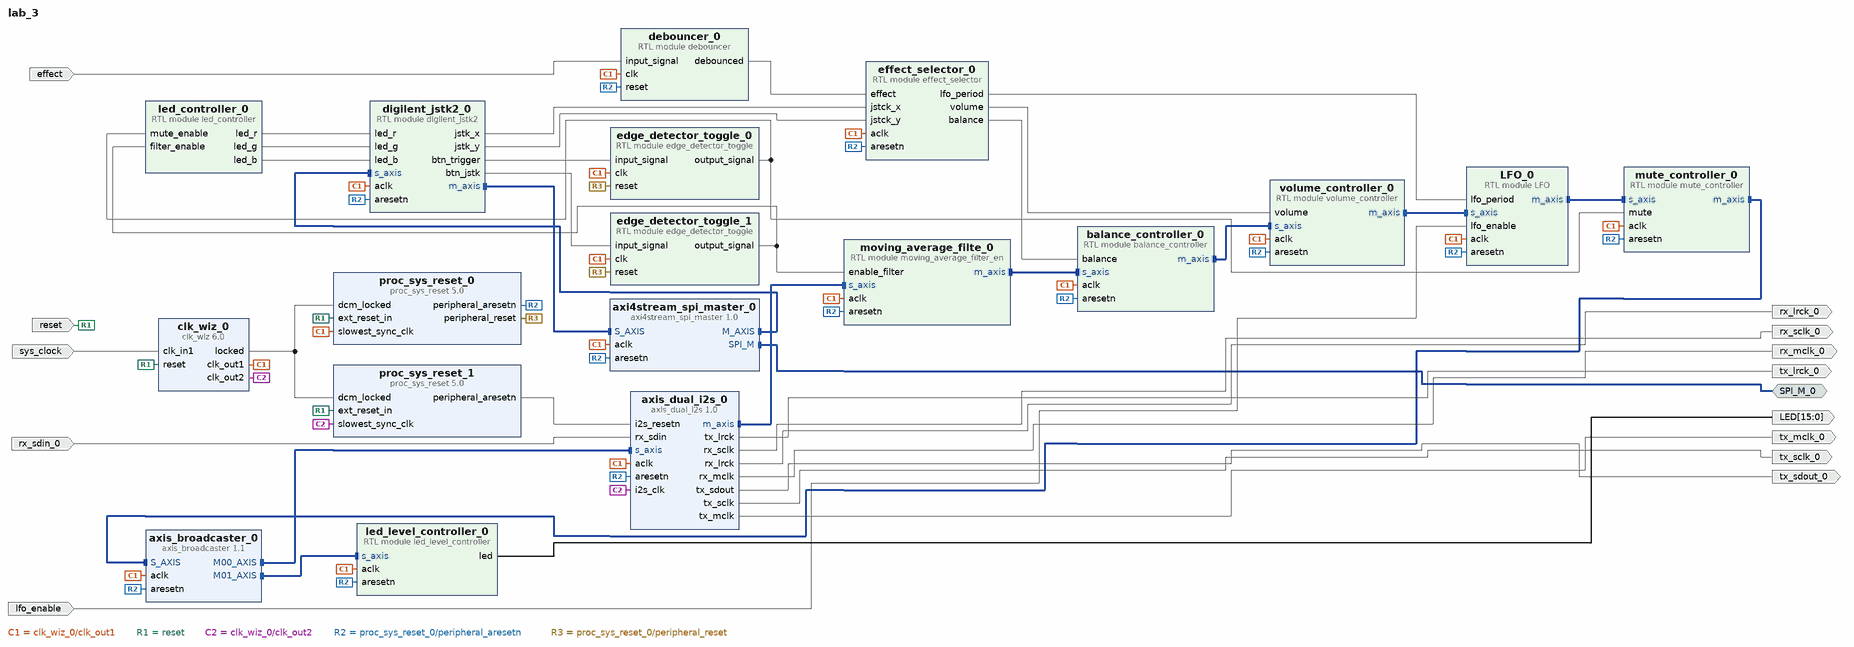
[diagram p0: block diagram of the top level]
# Vivado block design lab_3, xc7a35tcpg236-1, Vivado 2020.2
create_bd_design lab_3

create_bd_intf_port -mode Master -vlnv xilinx.com:interface:spi_rtl:1.0 SPI_M_0
create_bd_port -dir I -type clk sys_clock
set_property -dict {CONFIG.FREQ_HZ 100000000 CONFIG.PHASE 0.000} [get_bd_ports sys_clock]
create_bd_port -dir I -type rst reset
set_property -dict {CONFIG.POLARITY ACTIVE_HIGH} [get_bd_ports reset]
create_bd_port -dir O tx_lrck_0
create_bd_port -dir I rx_sdin_0
create_bd_port -dir O rx_sclk_0
create_bd_port -dir O rx_lrck_0
create_bd_port -dir O rx_mclk_0
create_bd_port -dir O tx_sdout_0
create_bd_port -dir O tx_sclk_0
create_bd_port -dir O tx_mclk_0
create_bd_port -dir I lfo_enable
create_bd_port -dir I effect
create_bd_port -dir O -from 15 -to 0 LED

create_bd_cell -type ip -vlnv xilinx.com:ip:clk_wiz:6.0 clk_wiz_0
set_property -dict [list \
  CONFIG.CLKOUT1_JITTER 149.337 \
  CONFIG.CLKOUT1_PHASE_ERROR 122.577 \
  CONFIG.CLKOUT1_REQUESTED_OUT_FREQ 100 \
  CONFIG.CLKOUT2_JITTER 201.826 \
  CONFIG.CLKOUT2_PHASE_ERROR 122.577 \
  CONFIG.CLKOUT2_REQUESTED_OUT_FREQ 22.579 \
  CONFIG.CLKOUT2_USED true \
  CONFIG.CLK_IN1_BOARD_INTERFACE sys_clock \
  CONFIG.MMCM_CLKFBOUT_MULT_F 7.000 \
  CONFIG.MMCM_CLKOUT0_DIVIDE_F 7.000 \
  CONFIG.MMCM_CLKOUT1_DIVIDE 31 \
  CONFIG.MMCM_DIVCLK_DIVIDE 1 \
  CONFIG.NUM_OUT_CLKS 2 \
  CONFIG.RESET_BOARD_INTERFACE reset \
  CONFIG.USE_BOARD_FLOW true \
  CONFIG.USE_LOCKED true \
] [get_bd_cells clk_wiz_0]
create_bd_cell -type ip -vlnv xilinx.com:ip:proc_sys_reset:5.0 proc_sys_reset_0
create_bd_cell -type ip -vlnv xilinx.com:ip:proc_sys_reset:5.0 proc_sys_reset_1
create_bd_cell -type module -reference digilent_jstk2 digilent_jstk2_0
set_property -dict {CONFIG.CLKFREQ 215000000} [get_bd_cells digilent_jstk2_0]
create_bd_cell -type module -reference edge_detector_toggle edge_detector_toggle_0
create_bd_cell -type module -reference edge_detector_toggle edge_detector_toggle_1
create_bd_cell -type module -reference debouncer debouncer_0
set_property -dict {CONFIG.CLOCK_FREQ 200000000} [get_bd_cells debouncer_0]
create_bd_cell -type ip -vlnv xilinx.com:ip:axis_broadcaster:1.1 axis_broadcaster_0
create_bd_cell -type module -reference moving_average_filter_en moving_average_filte_0
create_bd_cell -type module -reference volume_controller volume_controller_0
set_property -dict {CONFIG.LOWER_BOUND -8388608} [get_bd_cells volume_controller_0]
create_bd_cell -type module -reference LFO LFO_0
set_property -dict {CONFIG.CLK_PERIOD_NS 10} [get_bd_cells LFO_0]
create_bd_cell -type module -reference balance_controller balance_controller_0
create_bd_cell -type module -reference effect_selector effect_selector_0
create_bd_cell -type module -reference led_controller led_controller_0
create_bd_cell -type module -reference led_level_controller led_level_controller_0
set_property -dict {CONFIG.clock_period_ns 10} [get_bd_cells led_level_controller_0]
create_bd_cell -type module -reference mute_controller mute_controller_0
create_bd_cell -type ip -vlnv DigiLAB:ip:axi4stream_spi_master:1.0 axi4stream_spi_master_0
set_property -dict {CONFIG.c_clkfreq 215000000 CONFIG.c_sclkfreq 5000} [get_bd_cells axi4stream_spi_master_0]
create_bd_cell -type ip -vlnv DigiLAB:ip:axis_dual_i2s:1.0 axis_dual_i2s_0

# ---- connections ----

connect_bd_intf_net [get_bd_intf_pins axis_dual_i2s_0/m_axis] [get_bd_intf_pins moving_average_filte_0/s_axis]
connect_bd_intf_net [get_bd_intf_pins LFO_0/m_axis] [get_bd_intf_pins mute_controller_0/s_axis]
connect_bd_intf_net [get_bd_intf_pins digilent_jstk2_0/m_axis] [get_bd_intf_pins axi4stream_spi_master_0/S_AXIS]
connect_bd_intf_net [get_bd_intf_ports SPI_M_0] [get_bd_intf_pins axi4stream_spi_master_0/SPI_M]
connect_bd_intf_net [get_bd_intf_pins volume_controller_0/m_axis] [get_bd_intf_pins LFO_0/s_axis]
connect_bd_intf_net [get_bd_intf_pins mute_controller_0/m_axis] [get_bd_intf_pins axis_broadcaster_0/S_AXIS]
connect_bd_intf_net [get_bd_intf_pins axis_broadcaster_0/M01_AXIS] [get_bd_intf_pins led_level_controller_0/s_axis]
connect_bd_intf_net [get_bd_intf_pins axis_broadcaster_0/M00_AXIS] [get_bd_intf_pins axis_dual_i2s_0/s_axis]
connect_bd_intf_net [get_bd_intf_pins balance_controller_0/m_axis] [get_bd_intf_pins volume_controller_0/s_axis]
connect_bd_intf_net [get_bd_intf_pins balance_controller_0/s_axis] [get_bd_intf_pins moving_average_filte_0/m_axis]
connect_bd_intf_net [get_bd_intf_pins axi4stream_spi_master_0/M_AXIS] [get_bd_intf_pins digilent_jstk2_0/s_axis]
connect_bd_net [get_bd_ports sys_clock] [get_bd_pins clk_wiz_0/clk_in1]
connect_bd_net [get_bd_pins clk_wiz_0/clk_out1] \
  [get_bd_pins proc_sys_reset_0/slowest_sync_clk] [get_bd_pins digilent_jstk2_0/aclk] \
  [get_bd_pins edge_detector_toggle_0/clk] [get_bd_pins edge_detector_toggle_1/clk] [get_bd_pins debouncer_0/clk] \
  [get_bd_pins axis_broadcaster_0/aclk] [get_bd_pins moving_average_filte_0/aclk] [get_bd_pins volume_controller_0/aclk] \
  [get_bd_pins LFO_0/aclk] [get_bd_pins balance_controller_0/aclk] [get_bd_pins effect_selector_0/aclk] \
  [get_bd_pins led_level_controller_0/aclk] [get_bd_pins mute_controller_0/aclk] [get_bd_pins axi4stream_spi_master_0/aclk] \
  [get_bd_pins axis_dual_i2s_0/aclk]
connect_bd_net [get_bd_ports reset] \
  [get_bd_pins clk_wiz_0/reset] [get_bd_pins proc_sys_reset_0/ext_reset_in] [get_bd_pins proc_sys_reset_1/ext_reset_in]
connect_bd_net [get_bd_pins clk_wiz_0/locked] [get_bd_pins proc_sys_reset_0/dcm_locked] [get_bd_pins proc_sys_reset_1/dcm_locked]
connect_bd_net [get_bd_pins clk_wiz_0/clk_out2] [get_bd_pins proc_sys_reset_1/slowest_sync_clk] [get_bd_pins axis_dual_i2s_0/i2s_clk]
connect_bd_net [get_bd_pins proc_sys_reset_0/peripheral_aresetn] \
  [get_bd_pins digilent_jstk2_0/aresetn] [get_bd_pins debouncer_0/reset] [get_bd_pins axis_broadcaster_0/aresetn] \
  [get_bd_pins moving_average_filte_0/aresetn] [get_bd_pins volume_controller_0/aresetn] [get_bd_pins LFO_0/aresetn] \
  [get_bd_pins balance_controller_0/aresetn] [get_bd_pins effect_selector_0/aresetn] \
  [get_bd_pins led_level_controller_0/aresetn] [get_bd_pins mute_controller_0/aresetn] \
  [get_bd_pins axi4stream_spi_master_0/aresetn] [get_bd_pins axis_dual_i2s_0/aresetn]
connect_bd_net [get_bd_pins proc_sys_reset_1/peripheral_aresetn] [get_bd_pins axis_dual_i2s_0/i2s_resetn]
connect_bd_net [get_bd_pins axis_dual_i2s_0/tx_lrck] [get_bd_ports tx_lrck_0]
connect_bd_net -net rx_sdin_0_1 [get_bd_ports rx_sdin_0] [get_bd_pins axis_dual_i2s_0/rx_sdin]
connect_bd_net [get_bd_pins axis_dual_i2s_0/rx_sclk] [get_bd_ports rx_sclk_0]
connect_bd_net [get_bd_pins axis_dual_i2s_0/rx_lrck] [get_bd_ports rx_lrck_0]
connect_bd_net [get_bd_pins axis_dual_i2s_0/rx_mclk] [get_bd_ports rx_mclk_0]
connect_bd_net [get_bd_pins axis_dual_i2s_0/tx_sdout] [get_bd_ports tx_sdout_0]
connect_bd_net [get_bd_pins axis_dual_i2s_0/tx_sclk] [get_bd_ports tx_sclk_0]
connect_bd_net [get_bd_pins axis_dual_i2s_0/tx_mclk] [get_bd_ports tx_mclk_0]
connect_bd_net [get_bd_pins digilent_jstk2_0/btn_trigger] [get_bd_pins edge_detector_toggle_0/input_signal]
connect_bd_net [get_bd_pins digilent_jstk2_0/btn_jstk] [get_bd_pins edge_detector_toggle_1/input_signal]
connect_bd_net [get_bd_pins edge_detector_toggle_0/output_signal] [get_bd_pins led_controller_0/mute_enable] [get_bd_pins mute_controller_0/mute]
connect_bd_net [get_bd_pins edge_detector_toggle_1/output_signal] \
  [get_bd_pins moving_average_filte_0/enable_filter] [get_bd_pins led_controller_0/filter_enable]
connect_bd_net [get_bd_pins led_controller_0/led_r] [get_bd_pins digilent_jstk2_0/led_r]
connect_bd_net [get_bd_pins led_controller_0/led_g] [get_bd_pins digilent_jstk2_0/led_g]
connect_bd_net [get_bd_pins led_controller_0/led_b] [get_bd_pins digilent_jstk2_0/led_b]
connect_bd_net [get_bd_pins proc_sys_reset_0/peripheral_reset] [get_bd_pins edge_detector_toggle_1/reset] [get_bd_pins edge_detector_toggle_0/reset]
connect_bd_net [get_bd_pins digilent_jstk2_0/jstk_x] [get_bd_pins effect_selector_0/jstck_x]
connect_bd_net [get_bd_pins effect_selector_0/volume] [get_bd_pins volume_controller_0/volume]
connect_bd_net [get_bd_pins effect_selector_0/balance] [get_bd_pins balance_controller_0/balance]
connect_bd_net [get_bd_pins digilent_jstk2_0/jstk_y] [get_bd_pins effect_selector_0/jstck_y]
connect_bd_net [get_bd_pins effect_selector_0/lfo_period] [get_bd_pins LFO_0/lfo_period]
connect_bd_net -net lfo_enable_0_1 [get_bd_ports lfo_enable] [get_bd_pins LFO_0/lfo_enable]
connect_bd_net [get_bd_ports effect] [get_bd_pins debouncer_0/input_signal]
connect_bd_net [get_bd_pins led_level_controller_0/led] [get_bd_ports LED]
connect_bd_net [get_bd_pins debouncer_0/debounced] [get_bd_pins effect_selector_0/effect]

validate_bd_design
save_bd_design
